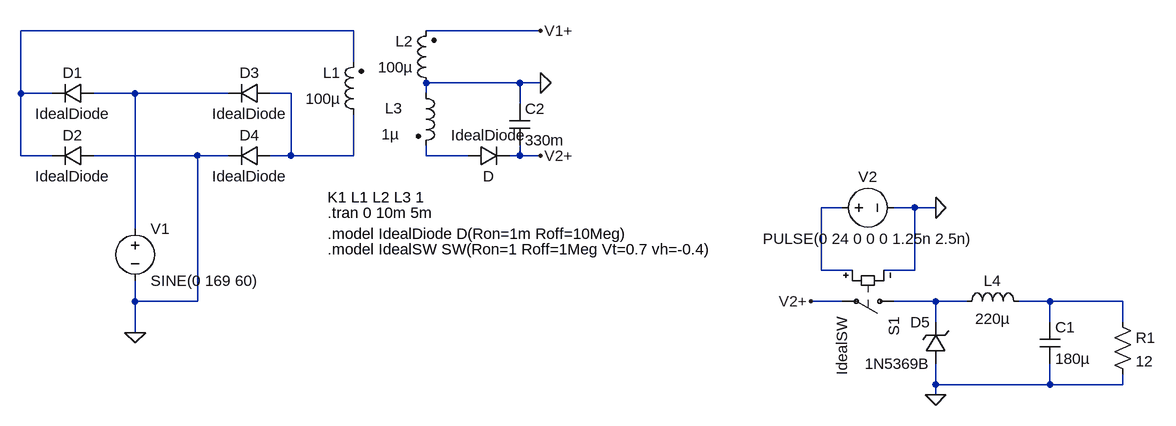
[diagram p0: schematic Power Supply.asc]
Power Supply.asc, the LTspice schematic file:
Version 4
SHEET 1 1768 680
WIRE 528 -224 16 -224
WIRE 816 -224 640 -224
WIRE 528 -176 528 -224
WIRE 784 -144 640 -144
WIRE 816 -144 784 -144
WIRE 16 -128 16 -224
WIRE 64 -128 16 -128
WIRE 192 -128 128 -128
WIRE 336 -128 192 -128
WIRE 432 -128 400 -128
WIRE 640 -128 640 -144
WIRE 784 -112 784 -144
WIRE 16 -32 16 -128
WIRE 64 -32 16 -32
WIRE 288 -32 128 -32
WIRE 336 -32 288 -32
WIRE 432 -32 432 -128
WIRE 432 -32 400 -32
WIRE 528 -32 528 -96
WIRE 528 -32 432 -32
WIRE 640 -32 640 -48
WIRE 704 -32 640 -32
WIRE 784 -32 784 -48
WIRE 784 -32 768 -32
WIRE 816 -32 784 -32
WIRE 1280 48 1248 48
WIRE 1392 48 1360 48
WIRE 1424 48 1392 48
WIRE 192 80 192 -128
WIRE 1248 144 1248 48
WIRE 1296 144 1248 144
WIRE 1392 144 1392 48
WIRE 1392 144 1344 144
WIRE 192 192 192 160
WIRE 288 192 288 -32
WIRE 288 192 192 192
WIRE 1280 192 1232 192
WIRE 1424 192 1360 192
WIRE 1472 192 1424 192
WIRE 1600 192 1552 192
WIRE 1712 192 1600 192
WIRE 1424 224 1424 192
WIRE 1600 224 1600 192
WIRE 1712 224 1712 192
WIRE 192 240 192 192
WIRE 1424 320 1424 288
WIRE 1600 320 1600 288
WIRE 1600 320 1424 320
WIRE 1712 320 1712 304
WIRE 1712 320 1600 320
WIRE 1424 336 1424 320
FLAG 192 240 0
FLAG 816 -144 0
FLAG 816 -224 V1+
FLAG 816 -32 V2+
FLAG 1232 192 V2+
FLAG 1424 336 0
FLAG 1424 48 0
SYMBOL voltage 192 64 R0
WINDOW 123 0 0 Left 0
WINDOW 39 0 0 Left 0
SYMATTR InstName V1
SYMATTR Value SINE(0 169 60)
SYMBOL diode 128 -144 R90
WINDOW 0 0 32 VBottom 2
WINDOW 3 32 32 VTop 2
SYMATTR InstName D1
SYMATTR Value IdealDiode
SYMBOL diode 128 -48 R90
WINDOW 0 0 32 VBottom 2
WINDOW 3 32 32 VTop 2
SYMATTR InstName D2
SYMATTR Value IdealDiode
SYMBOL diode 400 -144 R90
WINDOW 0 0 32 VBottom 2
WINDOW 3 32 32 VTop 2
SYMATTR InstName D3
SYMATTR Value IdealDiode
SYMBOL diode 400 -48 R90
WINDOW 0 0 32 VBottom 2
WINDOW 3 32 32 VTop 2
SYMATTR InstName D4
SYMATTR Value IdealDiode
SYMBOL ind2 656 -128 R180
WINDOW 0 36 80 Left 2
WINDOW 3 36 40 Left 2
SYMATTR InstName L2
SYMATTR Value 100µ
SYMATTR Type ind
SYMBOL ind2 544 -80 R180
WINDOW 0 36 80 Left 2
WINDOW 3 36 40 Left 2
SYMATTR InstName L1
SYMATTR Value 100µ
SYMATTR Type ind
SYMBOL ind2 624 -144 R0
WINDOW 0 -47 39 Left 2
WINDOW 3 -53 79 Left 2
SYMATTR InstName L3
SYMATTR Value 1µ
SYMATTR Type ind
SYMBOL zener 1440 288 R180
WINDOW 0 24 64 Left 2
WINDOW 3 24 0 Left 2
SYMATTR InstName D5
SYMATTR Value 1N5369B
SYMATTR Description Diode
SYMATTR Type diode
SYMBOL ind 1456 208 R270
WINDOW 0 32 56 VTop 2
WINDOW 3 5 56 VBottom 2
SYMATTR InstName L4
SYMATTR Value 220µ
SYMBOL cap 1584 224 R0
SYMATTR InstName C1
SYMATTR Value 180µ
SYMBOL res 1696 208 R0
SYMATTR InstName R1
SYMATTR Value 12
SYMBOL sw 1376 192 R90
SYMATTR InstName S1
SYMATTR Value IdealSW
SYMBOL voltage 1264 48 R270
WINDOW 0 32 56 VTop 2
WINDOW 3 -32 56 VBottom 2
WINDOW 123 0 0 Left 0
WINDOW 39 0 0 Left 0
SYMATTR InstName V2
SYMATTR Value PULSE(0 24 0 0 0 1.25n 2.5n)
SYMBOL diode 704 -16 R270
WINDOW 0 32 32 VTop 2
WINDOW 3 0 32 VBottom 2
SYMATTR InstName IdealDiode
SYMBOL cap 768 -112 R0
SYMATTR InstName C2
SYMATTR Value 330m
TEXT 488 56 Left 2 !.tran 0 10m 5m
TEXT 488 88 Left 2 !.model IdealDiode D(Ron=1m Roff=10Meg)
TEXT 488 32 Left 2 !K1 L1 L2 L3 1
TEXT 488 112 Left 2 !.model IdealSW SW(Ron=1 Roff=1Meg Vt=0.7 vh=-0.4)

The netlist it stands for:
* Power Supply.asc
V1 N002 0 SINE(0 169 60)
D1 N002 N001 IdealDiode
D2 0 N001 IdealDiode
D3 N003 N002 IdealDiode
D4 N003 0 IdealDiode
L2 0 V1+ 100µ
L1 N003 N001 100µ
L3 0 N004 1µ
D5 0 N006 1N5369B
L4 N006 N007 220µ
C1 N007 0 180µ
R1 N007 0 12
S1 N006 V2+ N005 0 IdealSW
V2 N005 0 PULSE(0 24 0 0 0 1.25n 2.5n)
D§IdealDiode N004 V2+ D
C2 0 V2+ 330m
.model D D
.lib standard.dio
.tran 0 10m 5m
.model IdealDiode D(Ron=1m Roff=10Meg)
K1 L1 L2 L3 1
.model IdealSW SW(Ron=1 Roff=1Meg Vt=0.7 vh=-0.4)
.backanno
.end